# Altium schematic sheet UART.SchDoc: USB to UART & DEBUG PORT
size A4; SheetNumber: 3; SheetTotal: 5; DOC_NO_SCH_DWG: #032024040602
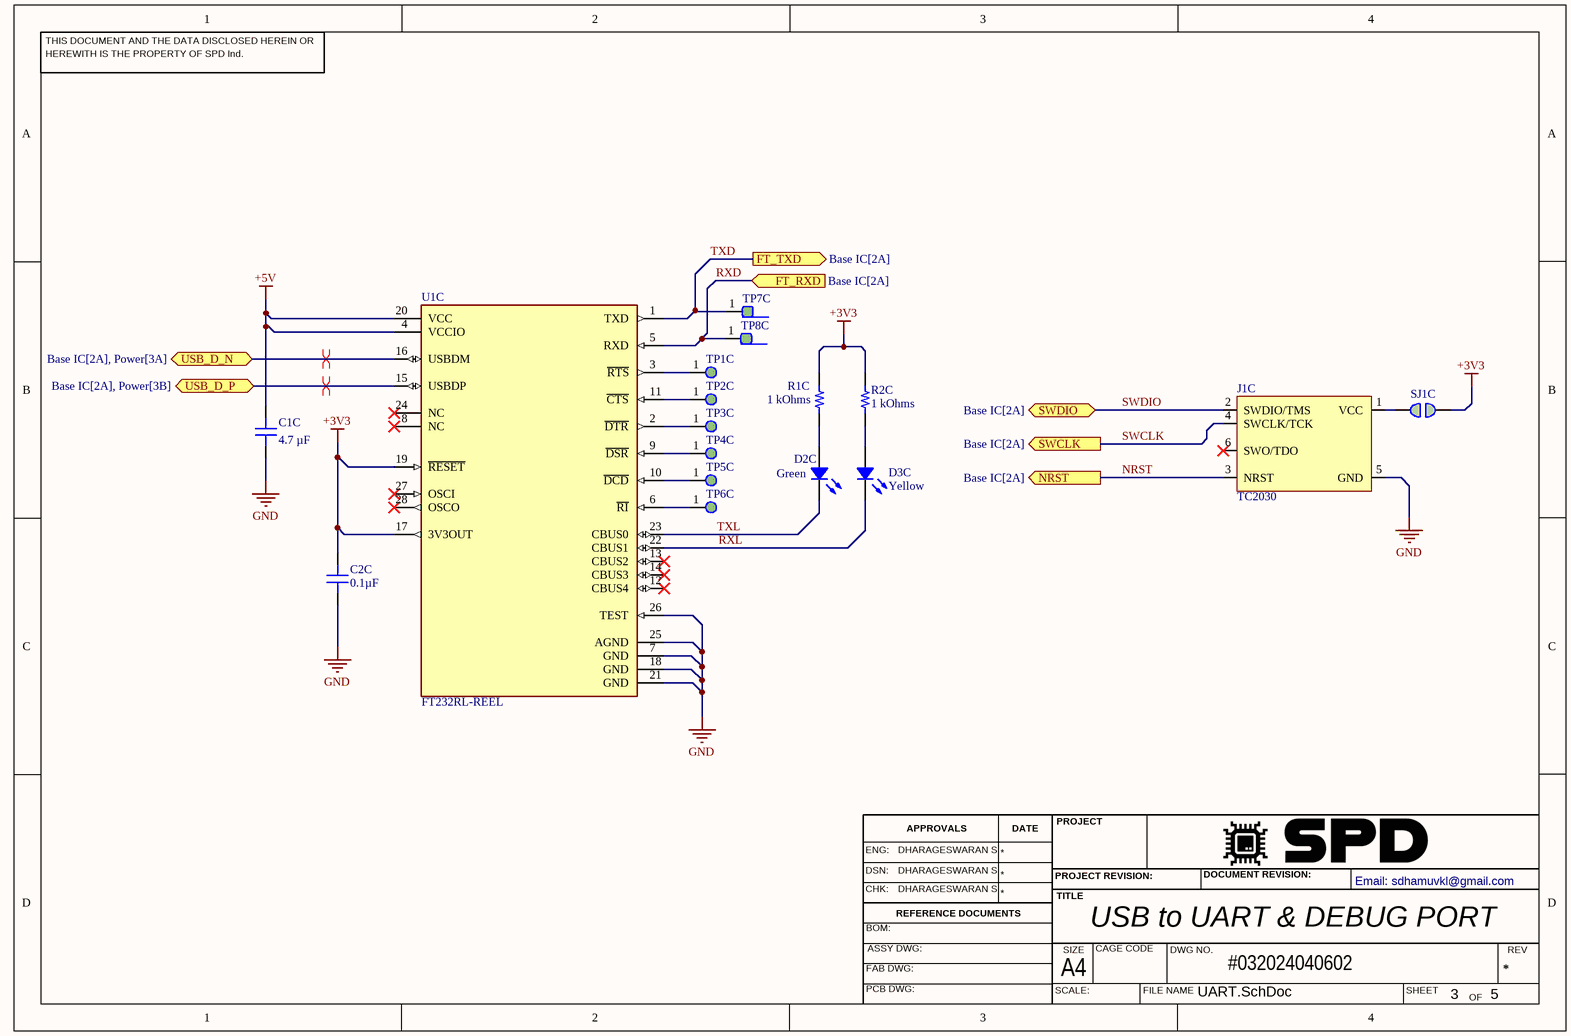
[diagram p0: UART.SchDoc]

## Parts
C1C  4.7 µF  [CAP 0603_1608]
C2C  0.1µF  [CAP 0603_1608]
D2C  Green  [LED 0603_1608 GREEN]
D3C  Yellow  [LED 0603_1608 YELLOW]
J1C  TC2030  [TC2030-FP]  (no BOM)
R1C  1 kOhms  [RES 0603_1608]
R2C  1 kOhms  [RES 0603_1608]
SJ1C  2PIN  [Rounded Jumper]  (value not drawn)
TP1C  ROUND PAD 2MM  [ROUND PAD 2MM]  (value not drawn)
TP2C  ROUND PAD 2MM  [ROUND PAD 2MM]  (value not drawn)
TP3C  ROUND PAD 2MM  [ROUND PAD 2MM]  (value not drawn)
TP4C  ROUND PAD 2MM  [ROUND PAD 2MM]  (value not drawn)
TP5C  ROUND PAD 2MM  [ROUND PAD 2MM]  (value not drawn)
TP6C  ROUND PAD 2MM  [ROUND PAD 2MM]  (value not drawn)
TP7C  SQUARE PAD 1.5MM  [SQUARE PAD 1.5MM]  (value not drawn)
TP8C  SQUARE PAD 1.5MM  [SQUARE PAD 1.5MM]  (value not drawn)
U1C  FT232RL-REEL  [FP-SSOP-28-MFG]

## Ports
FT_RXD (in, see Base IC[2A]), FT_TXD (out, see Base IC[2A]), NRST (out, see Base IC[2A]), SWCLK (out, see Base IC[2A]), SWDIO (bidir, see Base IC[2A]), USB_D_N (bidir, see Base IC[2A], Power[3A]), USB_D_P (bidir, see Base IC[2A], Power[3B])

## Nets
+3V3: C2C.2 R1C.2 R2C.2 SJ1C.2 U1C.17(3V3OUT) U1C.19(~{RESET})
+5V: C1C.2 U1C.4(VCCIO) U1C.20(VCC)
GND: C1C.1 C2C.1 J1C.5(GND) U1C.7(GND) U1C.18(GND) U1C.21(GND) U1C.25(AGND) U1C.26(TEST)
NRST: J1C.3(NRST) ; port NRST
RXD: TP8C.1 U1C.5(RXD) ; port FT_RXD
RXL: D3C.2 U1C.22(CBUS1)
SWCLK: J1C.4(SWCLK/TCK) ; port SWCLK
SWDIO: J1C.2(SWDIO/TMS) ; port SWDIO
TXD: TP7C.1 U1C.1(TXD) ; port FT_TXD
TXL: D2C.2 U1C.23(CBUS0)
USB_D_N: U1C.16(USBDM) ; port USB_D_N
USB_D_P: U1C.15(USBDP) ; port USB_D_P
NetD2C_1: D2C.1 R1C.1
NetD3C_1: D3C.1 R2C.1
NetJ1C_1: J1C.1(VCC) SJ1C.1
NetTP1C_1: TP1C.1 U1C.3(~{RTS})
NetTP2C_1: TP2C.1 U1C.11(~{CTS})
NetTP3C_1: TP3C.1 U1C.2(~{DTR})
NetTP4C_1: TP4C.1 U1C.9(~{DSR})
NetTP5C_1: TP5C.1 U1C.10(~{DCD})
NetTP6C_1: TP6C.1 U1C.6(~{RI})

Not connected (* = marked no-connect by the designer): J1C 6(SWO/TDO)*; U1C 8(NC)* 12(CBUS4)* 13(CBUS2)* 14(CBUS3)* 24(NC)* 27(OSCI)* 28(OSCO)*

## Layout directives
differential pair: USB_D_N, USB_D_P

## Notes on the sheet
- THIS DOCUMENT AND THE DATA DISCLOSED HEREIN OR
- HEREWITH IS THE PROPERTY OF SPD Ind.
- ENG:
- DHARAGESWARAN S
- APPROVALS
- DATE
- PROJECT
- DSN:
- CHK:
- REFERENCE DOCUMENTS
- PROJECT REVISION:
- TITLE
- DOCUMENT REVISION:
- Email: sdhamuvkl@gmail.com <https://github.com/DhamuVkl>
- BOM:
- FAB DWG:
- PCB DWG:
- ASSY DWG:
- SCALE:
- A4
- SIZE
- CAGE CODE
- FILE NAME
- DWG NO.
- SHEET
- REV
- OF

## Library data of the parts
C1C = GRM188C71A475KE11D: CAP CER 4.7UF 10V X7S 0603; Manufacturer: Murata Electronics; id: 84; Tolerance: ±10%; Part Number: GRM188C71A475KE11D; Value: 4.7 µF; Temperature Coefficient: X7S; Supplier Part Number 1: 490-11992-1-ND; ComponentLink2Description: DigiKey Link; ComponentLink1URL: https://search.murata.co.jp/Ceramy/image/img/A01X/G101/ENG/GRM188C71A475KE11-01.pdf; PartId: 2397; Supplier 1: DigiKey; Series: GRM; LastUpdated: 2023-01-03T20:07:47.610; Part Status: Active; Capacitance: 4.7 µF; Device Package: 0603 (1608 Metric); Thickness (Max): 0.037" (0.95mm); Voltage - Rated: 10V; Minimum Order: 1; Packaging: TapeAndReel; Applications: General Purpose; Package / Case: 0603 (1608 Metric); ComponentLink1Description: Datasheet; Price: 0.04; ComponentLink2URL: https://www.digikey.com/en/products/detail/murata-electronics/GRM188C71A475KE11D/4905309; Lifecycle Status: Active; Operating Temperature: -55°C ~ 125°C; Size / Dimension: 0.063" L x 0.031" W (1.60mm x 0.80mm); Mounting Type: Surface Mount, MLCC
C2C = LD03ZC104KAB2A: CAP CER 0.1UF 10V X7R 0603; Manufacturer: AVX Corporation; id: 3762; Tolerance: ±10%; Part Number: LD03ZC104KAB2A; Value: 0.1µF; Temperature Coefficient: X7R; Supplier Part Number 1: 478-12926-1-ND; ComponentLink2Description: DigiKey Link; ComponentLink1URL: http://datasheets.avx.com/LD-Series.pdf; PartId: 16481; Supplier 1: DigiKey; Series: LD; LastUpdated: 2020-09-02T01:03:06.140; Part Status: Active; Capacitance: 0.1µF; Device Package: 0603 (1608 Metric); Thickness (Max): 0.035" (0.90mm); Voltage - Rated: 10V; Minimum Order: 1; Packaging: TapeAndReel; Applications: General Purpose; Package / Case: 0603 (1608 Metric); ComponentLink1Description: Datasheet; Price: 0.17; ComponentLink2URL: http://digikey.com/product-detail/en/avx-corporation/LD03ZC104KAB2A/478-12926-1-ND/9949296; Lifecycle Status: Active; Operating Temperature: -55°C ~ 125°C; Size / Dimension: 0.063" L x 0.032" W (1.60mm x 0.81mm); Mounting Type: Surface Mount, MLCC
D2C = SML-LXFP0603SUGCTR: LED GREEN CLEAR SMD; Manufacturer: Lumex Opto/Components Inc.; id: 589; Lens Color: Colorless; Wavelength - Peak: 574nm; Lens Style: Rectangle with Flat Top; Viewing Angle: 130°; Lens Size: 1.60mm x 0.80mm; Configuration: Standard; Voltage - Forward (Vf) (Typ): 2V; Current - Test: 5mA; Millicandela Rating: 13mcd; Part Number: SML-LXFP0603SUGCTR; Supplier Part Number 1: 67-2222-1-ND; Lens Transparency: Clear; Supplier Device Package: SMD; ComponentLink1Description: Datasheet; Color: Green; ComponentLink2URL: https://www.digikey.com/en/products/detail/lumex-opto-components-inc/SML-LXFP0603SUGCTR/4496766; ComponentLink1URL: https://www.lumex.com/content/files/ProductAttachment/SML-LXFP0603SUGCTR.pdf; Supplier 1: DigiKey; Series: -; Height (Max): 0.20mm; Part Status: Active; ComponentLink2Description: DigiKey Link; Device Package: 0603 (1608 Metric); Packaging: TapeAndReel; Minimum Order: 1; Package / Case: 0603 (1608 Metric); PartId: 589; Lifecycle Status: Active; LastUpdated: 2023-01-02T20:56:41.527; Value: Green; Size / Dimension: 1.60mm L x 0.80mm W; Mounting Type: Surface Mount; Price: 0.07
D3C = VLMY1300-GS08: LED YELLOW 0603 SMD; Manufacturer: Vishay Semiconductor Opto Division; id: 107; Lens Color: 1.00mm; Wavelength - Peak: 588nm; Lens Style: Rectangle with Flat Top; Viewing Angle: 130°; Lens Size: 1.10mm x 0.80mm; Configuration: Standard; Wavelength - Dominant: 591nm; Voltage - Forward (Vf) (Typ): 2.1V; Current - Test: 20mA; Millicandela Rating: 104mcd; Part Number: VLMY1300-GS08; Supplier Part Number 1: VLMY1300-GS08CT-ND; Supplier Device Package: 0603; ComponentLink1Description: Datasheet; Color: Yellow; ComponentLink2URL: https://www.digikey.com/en/products/detail/vishay-semiconductor-opto-division/VLMY1300-GS08/2813349; ComponentLink1URL: http://www.vishay.com/docs/82437/vlmo1300.pdf; Supplier 1: DigiKey; Series: CHIPLED; Height (Max): 1.00mm; Part Status: Active; ComponentLink2Description: DigiKey Link; Device Package: 0603 (1608 Metric); Packaging: TapeAndReel; Minimum Order: 1; Package / Case: 0603 (1608 Metric); PartId: 107; Lifecycle Status: Active; LastUpdated: 2023-01-02T20:57:39.580; Value: Yellow; Size / Dimension: 1.60mm L x 0.80mm W; Mounting Type: Surface Mount; Price: 0.05
J1C = TC2030: Tag-Connect No-Solder SWD Debug Connector DO NOT PLACE; Manufacturer: Tag-Connect; Manufacturer Part Number: TC2030; Supplier 1: Digikey; Supplier Part Number 1: TC2030-MCP-NLTC-ND
R1C R2C = CPF0603B1K0E: RES SMD 1K OHM 0.1% 1/16W 0603; Manufacturer: TE Connectivity Passive Product; id: 16; Temperature Coefficient: ±25ppm/°C; Power (Watts): 0.063W, 1/16W; Part Number: CPF0603B1K0E; Height - Seated (Max): 0.022" (0.55mm); Supplier Part Number 1: A119887CT-ND; Supplier Device Package: 0603; ComponentLink1Description: Datasheet; ComponentLink2URL: https://www.digikey.com/en/products/detail/te-connectivity-passive-product/CPF0603B1K0E/2390473; ComponentLink1URL: https://www.te.com/commerce/DocumentDelivery/DDEController?Action=srchrtrv&DocNm=1773200&DocType=DS&DocLang=English; Composition: Thin Film; Tolerance: ±0.1%; Supplier 1: DigiKey; Series: CPF, Neohm; Part Status: Active; ComponentLink2Description: DigiKey Link; Device Package: 0603 (1608 Metric); Packaging: TapeAndReel; Minimum Order: 1; Package / Case: 0603 (1608 Metric); PartId: 4877; Lifecycle Status: Active; LastUpdated: 2023-01-02T20:30:26.897; Operating Temperature: -55°C ~ 155°C; Number Of Terminations: 2; Value: 1 kOhms; Size / Dimension: 0.061" L x 0.031" W (1.55mm x 0.80mm); Price: 0.09; Resistance: 1 kOhms
SJ1C = Rounded Jumper
U1C = CMP-0078-00029-4: IC USB FS SERIAL UART 28-SSOP; Data Rate: 12Mbps; Max Supply Voltage: 5.25V; Operating Supply Current: 15mA; Number of Channels: 1; Voltage: 5V; Min Supply Voltage: 3.3V; Radiation Hardening: No; Mount: Surface Mount; Min Operating Temperature: -40°C; Package Quantity: 2000; Number of Transceivers: 1; Width: 5.3mm; Number of Pins: 28; Height: 1.75mm; Weight: 0.080001oz; Lead Free: Lead Free; Length: 10.2mm; REACH SVHC: No SVHC; Max Operating Temperature: 85°C; Packaging: Tape and Reel; Interface: UART; Case/Package: SSOP